# Altium schematic sheet P1IO.SchDoc
size A4
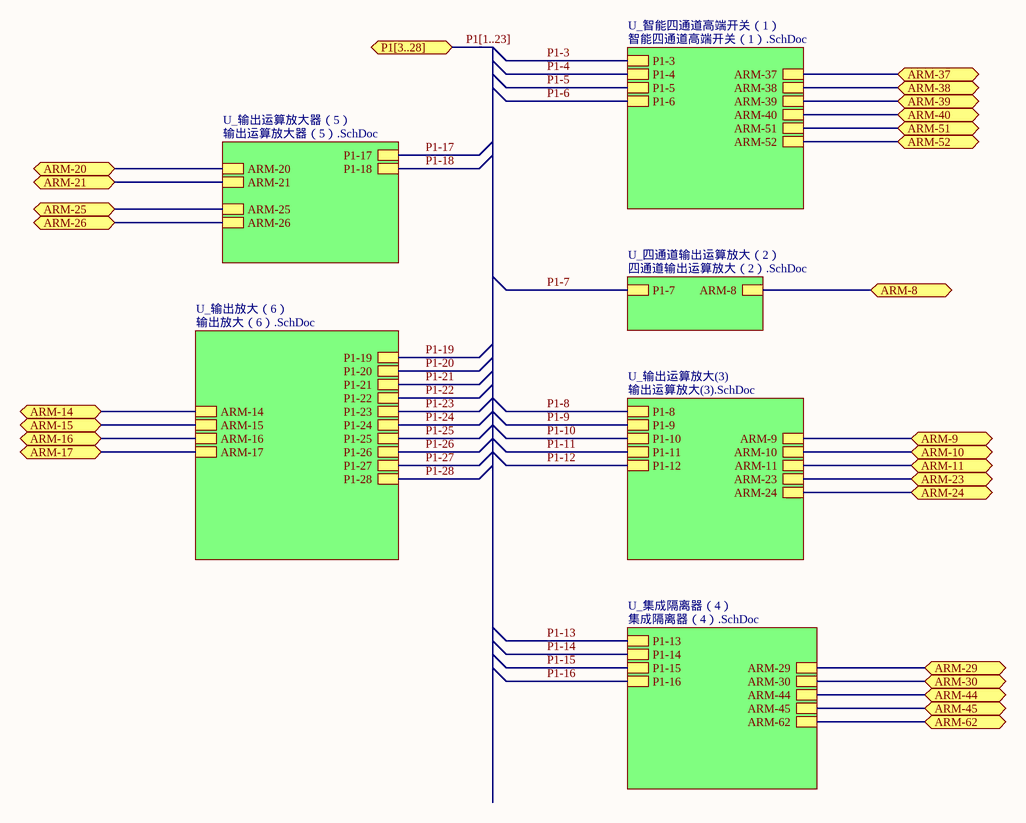
[diagram p0: P1IO.SchDoc]

## Sub-sheets
U_四通道输出运算放大（2） = 四通道输出运算放大（2）.SchDoc: P1-7, ARM-8
U_智能四通道高端开关（1） = 智能四通道高端开关（1）.SchDoc: P1-3, ARM-52, ARM-38, ARM-51, ARM-37, ARM-40, ARM-39, P1-4, P1-5, P1-6
U_输出放大（6） = 输出放大（6）.SchDoc: P1-19, P1-20, P1-21, P1-22, P1-23, P1-24, P1-25, P1-26, P1-27, P1-28, ARM-14, ARM-15, ARM-16, ARM-17
U_输出运算放大(3) = 输出运算放大(3).SchDoc: P1-8, ARM-11, P1-9, P1-10, P1-11, P1-12, ARM-9, ARM-24, ARM-23, ARM-10
U_输出运算放大器（5） = 输出运算放大器（5）.SchDoc: P1-17, P1-18, ARM-25, ARM-20, ARM-21, ARM-26
U_集成隔离器（4） = 集成隔离器（4）.SchDoc: P1-13, P1-14, P1-15, P1-16, ARM-62, ARM-30, ARM-29, ARM-44, ARM-45

## Ports
ARM-8, ARM-9, ARM-10, ARM-11, ARM-14, ARM-15, ARM-16, ARM-17, ARM-20, ARM-21, ARM-23, ARM-24, ARM-25, ARM-26, ARM-29, ARM-30, ARM-37, ARM-38, ARM-39, ARM-40, ARM-44, ARM-45, ARM-51, ARM-52, ARM-62, P1[3..28]

## Nets
ARM-8: port ARM-8, sheet U_四通道输出运算放大（2）/ARM-8
ARM-9: port ARM-9, sheet U_输出运算放大(3)/ARM-9
ARM-10: port ARM-10, sheet U_输出运算放大(3)/ARM-10
ARM-11: port ARM-11, sheet U_输出运算放大(3)/ARM-11
ARM-14: port ARM-14, sheet U_输出放大（6）/ARM-14
ARM-15: port ARM-15, sheet U_输出放大（6）/ARM-15
ARM-16: port ARM-16, sheet U_输出放大（6）/ARM-16
ARM-17: port ARM-17, sheet U_输出放大（6）/ARM-17
ARM-20: port ARM-20, sheet U_输出运算放大器（5）/ARM-20
ARM-21: port ARM-21, sheet U_输出运算放大器（5）/ARM-21
ARM-23: port ARM-23, sheet U_输出运算放大(3)/ARM-23
ARM-24: port ARM-24, sheet U_输出运算放大(3)/ARM-24
ARM-25: port ARM-25, sheet U_输出运算放大器（5）/ARM-25
ARM-26: port ARM-26, sheet U_输出运算放大器（5）/ARM-26
ARM-29: port ARM-29, sheet U_集成隔离器（4）/ARM-29
ARM-30: port ARM-30, sheet U_集成隔离器（4）/ARM-30
ARM-37: port ARM-37, sheet U_智能四通道高端开关（1）/ARM-37
ARM-38: port ARM-38, sheet U_智能四通道高端开关（1）/ARM-38
ARM-39: port ARM-39, sheet U_智能四通道高端开关（1）/ARM-39
ARM-40: port ARM-40, sheet U_智能四通道高端开关（1）/ARM-40
ARM-44: port ARM-44, sheet U_集成隔离器（4）/ARM-44
ARM-45: port ARM-45, sheet U_集成隔离器（4）/ARM-45
ARM-51: port ARM-51, sheet U_智能四通道高端开关（1）/ARM-51
ARM-52: port ARM-52, sheet U_智能四通道高端开关（1）/ARM-52
ARM-62: port ARM-62, sheet U_集成隔离器（4）/ARM-62
P1-3: sheet U_智能四通道高端开关（1）/P1-3
P1-4: sheet U_智能四通道高端开关（1）/P1-4
P1-5: sheet U_智能四通道高端开关（1）/P1-5
P1-6: sheet U_智能四通道高端开关（1）/P1-6
P1-7: sheet U_四通道输出运算放大（2）/P1-7
P1-8: sheet U_输出运算放大(3)/P1-8
P1-9: sheet U_输出运算放大(3)/P1-9
P1-10: sheet U_输出运算放大(3)/P1-10
P1-11: sheet U_输出运算放大(3)/P1-11
P1-12: sheet U_输出运算放大(3)/P1-12
P1-13: sheet U_集成隔离器（4）/P1-13
P1-14: sheet U_集成隔离器（4）/P1-14
P1-15: sheet U_集成隔离器（4）/P1-15
P1-16: sheet U_集成隔离器（4）/P1-16
P1-17: sheet U_输出运算放大器（5）/P1-17
P1-18: sheet U_输出运算放大器（5）/P1-18
P1-19: sheet U_输出放大（6）/P1-19
P1-20: sheet U_输出放大（6）/P1-20
P1-21: sheet U_输出放大（6）/P1-21
P1-22: sheet U_输出放大（6）/P1-22
P1-23: sheet U_输出放大（6）/P1-23
P1-24: sheet U_输出放大（6）/P1-24
P1-25: sheet U_输出放大（6）/P1-25
P1-26: sheet U_输出放大（6）/P1-26
P1-27: sheet U_输出放大（6）/P1-27
P1-28: sheet U_输出放大（6）/P1-28

## Buses and harness runs
bus P1[1..23] = port P1[3..28]